# Altium schematic sheet MCU.SchDoc: 1/2
size A4
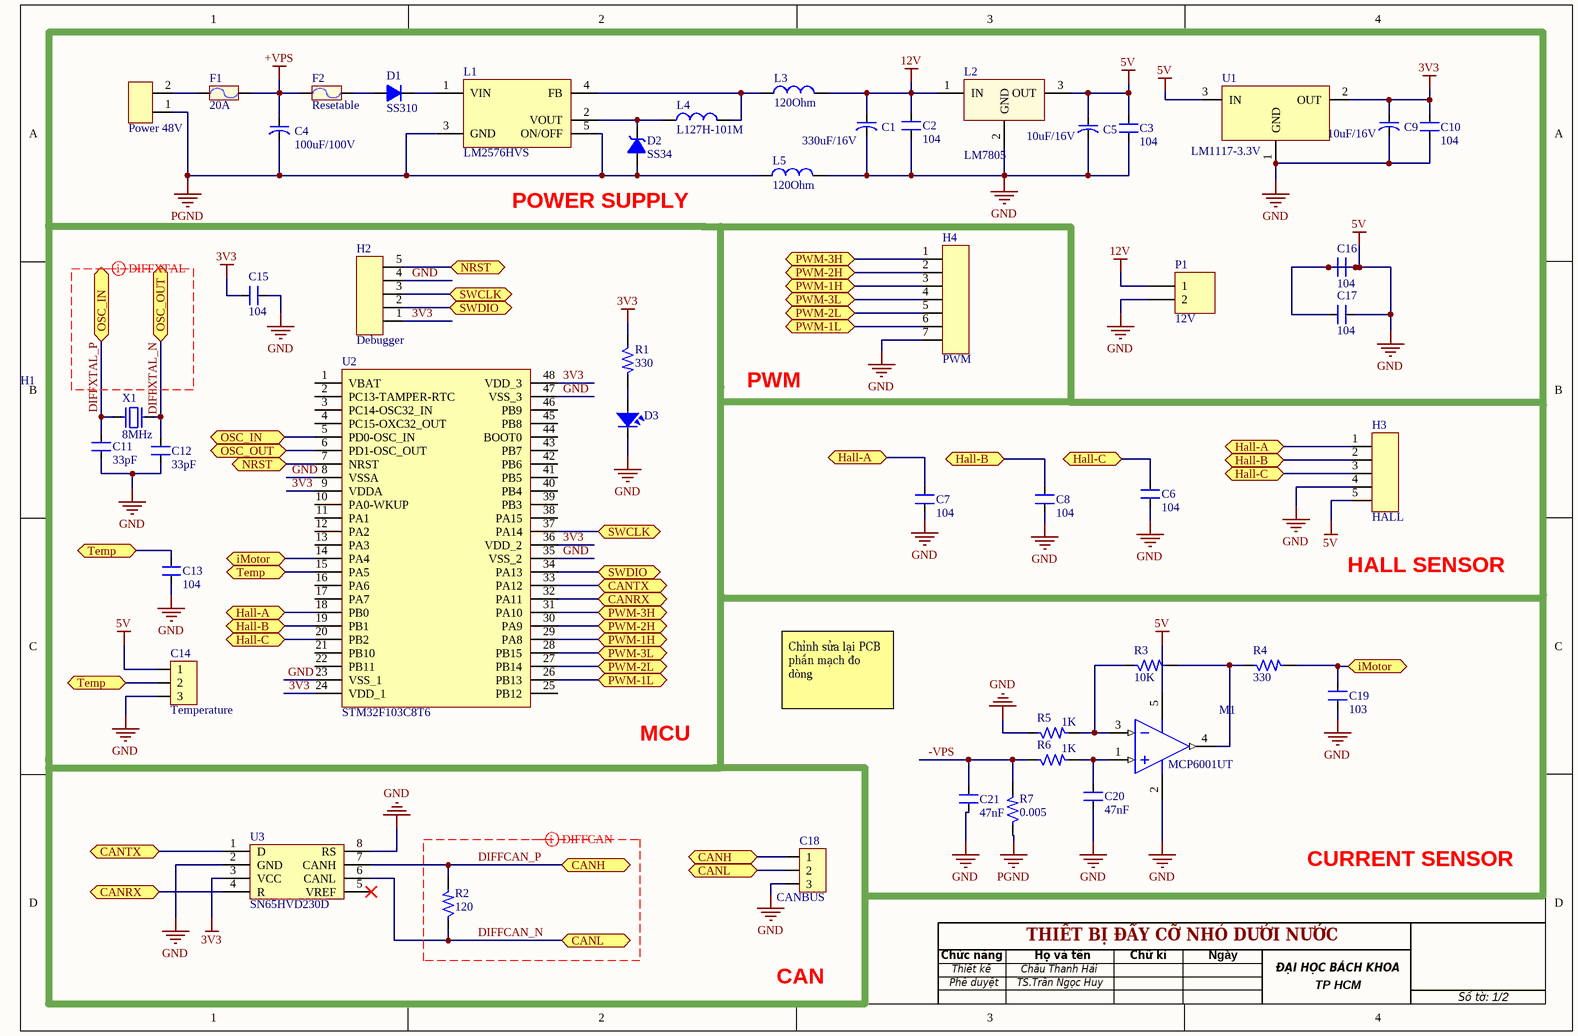
[diagram p0: MCU.SchDoc]

## Parts
C1  330uF/16V  [330uF/16V]
C2  104  [Non-Capacitor 104 SMD]
C3  104  [Non-Capacitor 104 SMD]
C4  100uF/100V  [100uF/100V]
C5  10uF/16V  [10uF/16V]
C6  104  [Non-Capacitor 104 SMD]
C7  104  [Non-Capacitor 104 SMD]
C8  104  [Non-Capacitor 104 SMD]
C9  10uF/16V  [10uF/16V]
C10  104  [Non-Capacitor 104 SMD]
C11  33pF  [Non-Capacitor 104 SMD]
C12  33pF  [Non-Capacitor 104 SMD]
C13  104  [Non-Capacitor 104 SMD]
C14  Temperature  [Header3]
C15  104  [Non-Capacitor 104 SMD]
C16  104  [Non-Capacitor 104 SMD]
C17  104  [Non-Capacitor 104 SMD]
C18  CANBUS  [Header3]
C19  103  [Non-Capacitor 104 SMD]
C20  47nF  [Non-Capacitor 104 SMD]
C21  47nF  [Non-Capacitor 104 SMD]
D1  SS310  [SS310]
D2  SS34  [SS34]
D3  LED SMD0603  [Led SMD0603]  (value not drawn)
F1  20A  [Fuse 20A]
F2  Resetable  [PTC Resettable Fuses]
H1  Power 48V  [Header 2]
H2  Debugger  [Header 5]
H3  HALL  [Header_5_B]
H4  PWM  [Header 7 Male]
L1  LM2576HVS  [LM2576 SMD]
L2  LM7805  [LM7805 SMD]
L3  120Ohm  [Ferrite Beads]
L4  L127H-101M  [L127H-101M]
L5  120Ohm  [Ferrite Beads]
M1  MCP6001UT  [MCP6001UT]
P1  12V  [HDR1X2]
R1  330  [Resistor SMD 0603]
R2  120  [Resistor SMD 0603]
R3  10K  [Resistor SMD 0603]
R4  330  [Resistor SMD 0603]
R5  1K  [Resistor SMD 0603]
R6  1K  [Resistor SMD 0603]
R7  0.005  [Shunt]
U1  LM1117-3.3V  [SOT223]
U2  STM32F103C8T6  [STM32F103C8T6]
U3  SN65HVD230D  [SN65HVD230D]
X1  8MHz  [Crystal]

## Ports
CANH (bidir), CANL (bidir), CANRX (bidir), CANTX (bidir), Hall-A (bidir), Hall-B (bidir), Hall-C (bidir), iMotor (bidir), NRST (bidir), OSC_IN (bidir), OSC_OUT (bidir), PWM-1H (bidir), PWM-1L (bidir), PWM-2H (bidir), PWM-2L (bidir), PWM-3H (bidir), PWM-3L (bidir), SWCLK (bidir), SWDIO (bidir), Temp (bidir)

## Nets
3V3: C9.1 C10.2 C15.2 H2.1 R1.1 U1.2(OUT) U2.9(VDDA) U2.24(VDD_1) U2.36(VDD_2) U2.48(VDD_3) U3.3(VCC)
12V: C1.1 C2.2 L2.1(IN) L3.2 P1.1
+VPS: C4.1 F1.2 F2.1
GND: C1.2 C2.1 C3.1 C3.2 C5.1 C5.2 C6.1 C7.1 C8.1 C9.2 C10.1 C11.1 C12.1 C13.2 C14.1 C14.3 C15.1 C16.1 C16.2 C17.1 C17.2 C18.3 C19.1 C20.1 C21.1 D3.2 H2.4 H3.4 H3.5 H4.7 L2.2(GND) L2.3(OUT) L5.2 M1.2(V-) M1.5(V+) P1.2 R5.1 U1.1(GND) U1.3(IN) U2.8(VSSA) U2.23(VSS_1) U2.35(VSS_2) U2.47(VSS_3) U3.2(GND) U3.8(RS)  [also labelled 5V]
PGND: C4.2 D2.2(A) H1.1 L1.3(GND) L1.5(ON/OFF) L5.1 R7.1
-VPS: C21.2 R6.1 R7.2
CANRX: U2.32(PA11) U3.4(R) ; port CANRX
CANTX: U2.33(PA12) U3.1(D) ; port CANTX
DIFFCAN_N: C18.2 R2.1 U3.6(CANL) ; port CANL
DIFFCAN_P: C18.1 R2.2 U3.7(CANH) ; port CANH
DIFFXTAL_N: C12.2 U2.6(PD1-OSC_OUT) X1.2 ; port OSC_OUT
DIFFXTAL_P: C11.2 U2.5(PD0-OSC_IN) X1.1 ; port OSC_IN
Hall-A: C7.2 H3.1 U2.18(PB0) ; port Hall-A
Hall-B: C8.2 H3.2 U2.19(PB1) ; port Hall-B
Hall-C: C6.2 H3.3 U2.20(PB2) ; port Hall-C
iMotor: C19.2 R4.2 U2.14(PA4) ; port iMotor
NRST: H2.5 U2.7(NRST) ; port NRST
PWM-1H: H4.3 U2.29(PA8) ; port PWM-1H
PWM-1L: H4.6 U2.26(PB13) ; port PWM-1L
PWM-2H: H4.2 U2.30(PA9) ; port PWM-2H
PWM-2L: H4.5 U2.27(PB14) ; port PWM-2L
PWM-3H: H4.1 U2.31(PA10) ; port PWM-3H
PWM-3L: H4.4 U2.28(PB15) ; port PWM-3L
SWCLK: H2.3 U2.37(PA14) ; port SWCLK
SWDIO: H2.2 U2.34(PA13) ; port SWDIO
Temp: C13.1 C14.2 U2.15(PA5) ; port Temp
NetC20_2: C20.2 M1.1(IN-) R6.2
NetD1_1: D1.1(K) L1.1(VIN)
NetD1_2: D1.2(A) F2.2
NetD2_1: D2.1(K) L1.2(VOUT) L4.1
NetD3_1: D3.1 R1.2
NetF1_1: F1.1 H1.2
NetL1_4: L1.4(FB) L3.1 L4.2
NetM1_3: M1.3(IN+) R3.1 R5.2
NetM1_4: M1.4(OUT) R3.2 R4.1

Not connected (* = marked no-connect by the designer): U2 1(VBAT) 2(PC13-TAMPER-RTC) 3(PC14-OSC32_IN) 4(PC15-OXC32_OUT) 10(PA0-WKUP) 11(PA1) 12(PA2) 13(PA3) 16(PA6) 17(PA7) 21(PB10) 22(PB11) 25(PB12) 38(PA15) 39(PB3) 40(PB4) 41(PB5) 42(PB6) 43(PB7) 44(BOOT0) 45(PB8) 46(PB9); U3 5(VREF)*

## Layout directives
differential pair: (no net found under the mark), DIFFCAN_N, DIFFCAN_P

## Notes on the sheet
- POWER SUPPLY
- PWM
- HALL SENSOR
- Chỉnh sửa lại PCB phần mạch đo dòng
- MCU
- CURRENT SENSOR
- CAN
- Chức năng
- Phê duyệt
- Thiết kế
- TS.Trần Ngọc Huy
- Châu Thanh Hải
- THIẾT BỊ ĐẨY CỠ NHỎ DƯỚI NƯỚC
- Họ và tên
- Chữ kí
- Ngày
- ĐẠI HỌC BÁCH KHOA
- TP HCM
- Số tờ:

## Library data of the parts
C4 = Polary Capacitor: DIP Footprint
C11 C12 C19-C21 = 104
C14 C18 = Header3: Header IDC, 3 x 1 Pin Vertical 2.54mm Pitch (Non-Boxed, Male); Manufacturer: W¨¹rth Elektronik eiSos GmbH; partNo: 613002143121; ComponentLink1 Description: Manufacturer; ComponentLink2 Description: Datasheet; NoPins: 02; Created Date: 29 March 2013; ComponentLink1URL: http://www.we-online.com; ComponentLink2URL: http://katalog.we-online.de/em/datasheet/6130xx143121.pdf; Created by: Karrer Zheng
F1 F2 = Fuse
H1 = Header 2x1
H2 H3 = Header 5x1
H4 = Header 7x1
L3 L5 = Ferrite Beads
P1 = Header 2: Header, 2-Pin; LatestRevisionDate: 17-Jul-2002; LatestRevisionNote: Re-released for DXP Platform.; Publisher: Altium Limited
R1-R6 = Resistors
R7 = Shunt Resistor
U1 = LM1117: 800mA Low-Dropout Linear Regulator; Creator: Nguyen Ba Bien; Website: http://group3i.net
U2 = STM32F103C8T6: ARM® 32-bit Cortex®-M3
X1 = Crystal